# EAGLE design amp-full-0_0_0_1 (EAGLE 6.4)

## Sheet 1 of 3
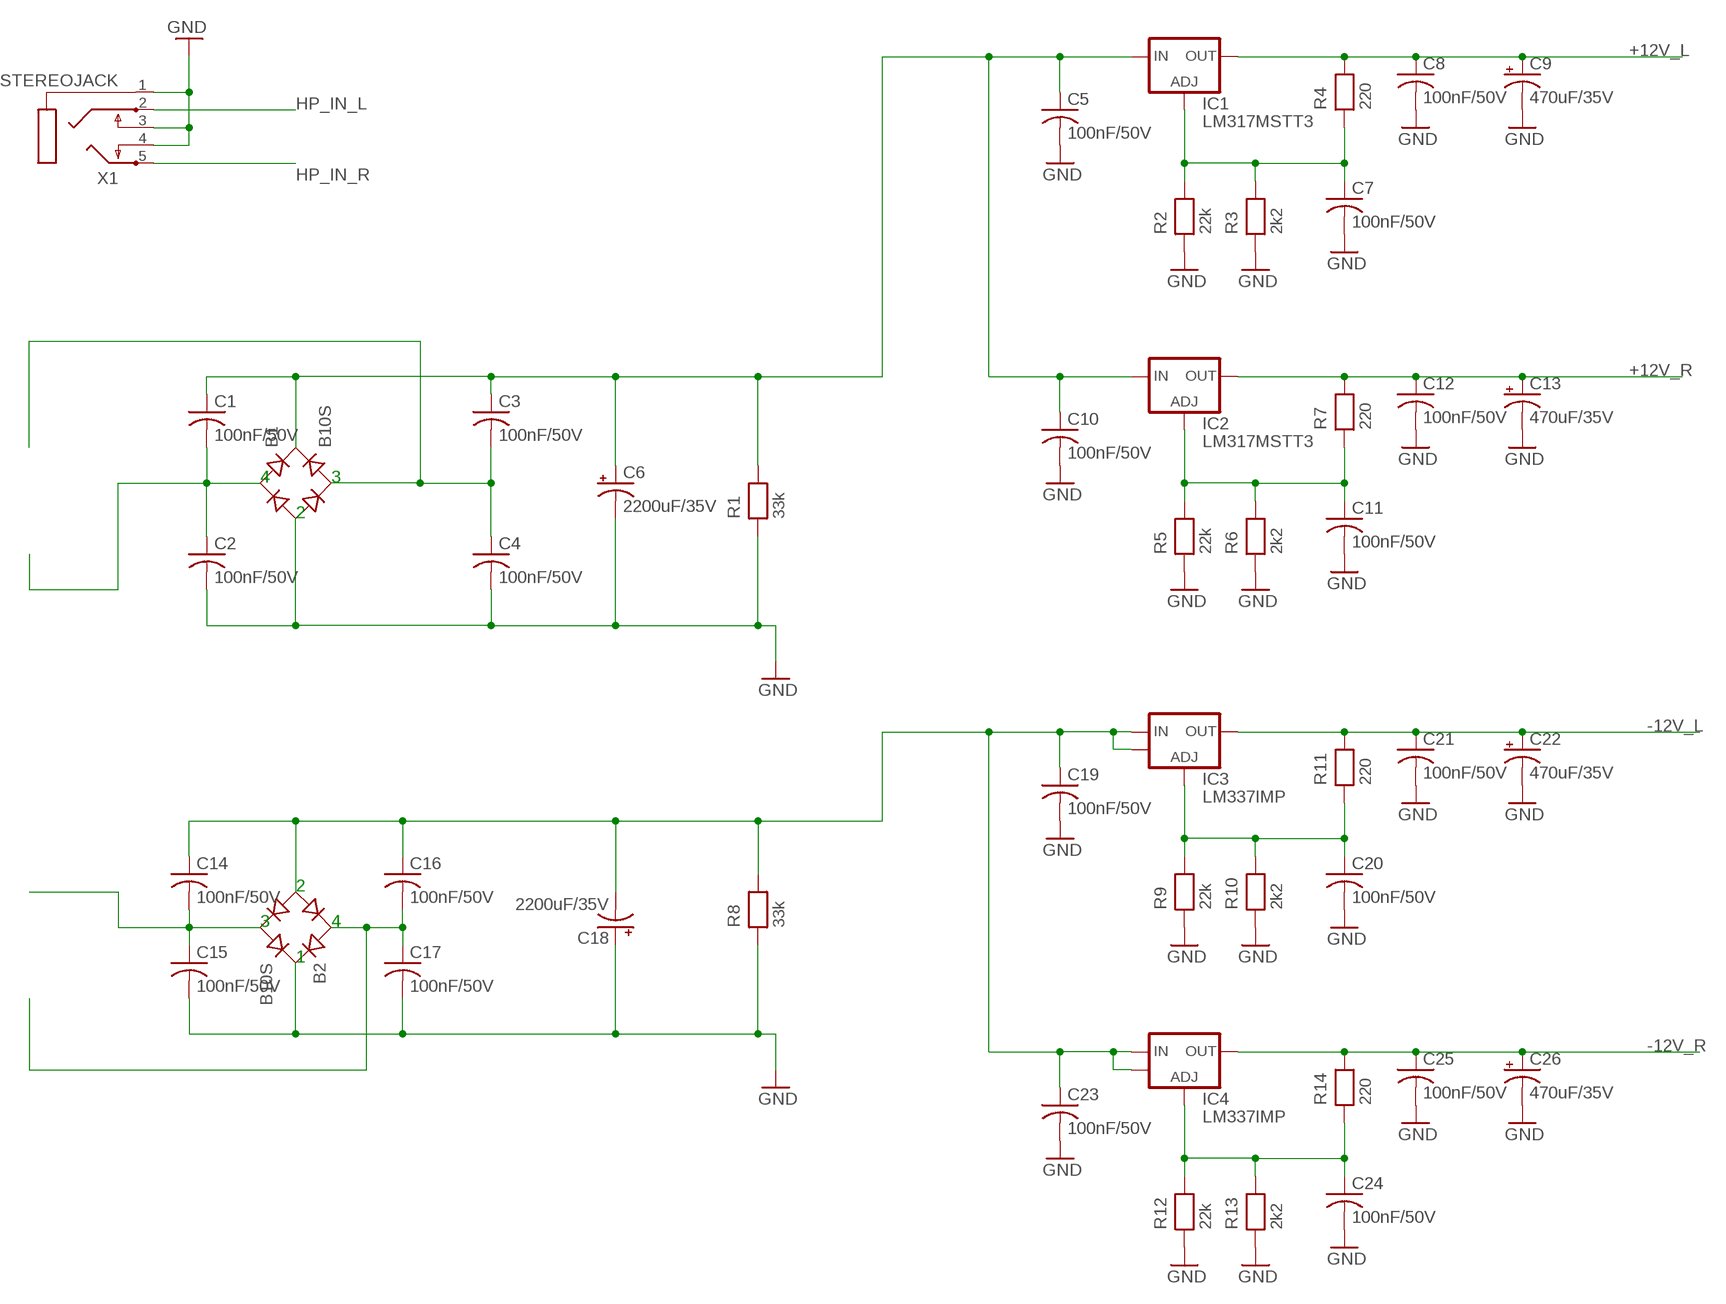
[diagram p0: schematic, sheet 1]

### Parts
B1  B10S  [MBS]
B2  B10S  [MBS]
C1  100nF/50V  C-USC0805  [C0805]
C2  100nF/50V  C-USC0805  [C0805]
C3  100nF/50V  C-USC0805  [C0805]
C4  100nF/50V  C-USC0805  [C0805]
C5  100nF/50V  C-USC0805  [C0805]
C6  2200uF/35V  CPOL-USE7.5-16  [E7,5-16]
C7  100nF/50V  C-USC0805  [C0805]
C8  100nF/50V  C-USC0805  [C0805]
C9  470uF/35V  CPOL-USE3.5-10  [E3,5-10]
C10  100nF/50V  C-USC0805  [C0805]
C11  100nF/50V  C-USC0805  [C0805]
C12  100nF/50V  C-USC0805  [C0805]
C13  470uF/35V  CPOL-USE3.5-10  [E3,5-10]
C14  100nF/50V  C-USC0805  [C0805]
C15  100nF/50V  C-USC0805  [C0805]
C16  100nF/50V  C-USC0805  [C0805]
C17  100nF/50V  C-USC0805  [C0805]
C18  2200uF/35V  CPOL-USE7.5-16  [E7,5-16]
C19  100nF/50V  C-USC0805  [C0805]
C20  100nF/50V  C-USC0805  [C0805]
C21  100nF/50V  C-USC0805  [C0805]
C22  470uF/35V  CPOL-USE3.5-10  [E3,5-10]
C23  100nF/50V  C-USC0805  [C0805]
C24  100nF/50V  C-USC0805  [C0805]
C25  100nF/50V  C-USC0805  [C0805]
C26  470uF/35V  CPOL-USE3.5-10  [E3,5-10]
IC1  LM317MSTT3  [SOT223]
IC2  LM317MSTT3  [SOT223]
IC3  LM337IMP  [SOT-223]
IC4  LM337IMP  [SOT-223]
R1  33k  PRES0805LEVEL3  [R0805]
R2  22k  PRES0805LEVEL3  [R0805]
R3  2k2  PRES0805LEVEL3  [R0805]
R4  220  PRES0805LEVEL3  [R0805]
R5  22k  PRES0805LEVEL3  [R0805]
R6  2k2  PRES0805LEVEL3  [R0805]
R7  220  PRES0805LEVEL3  [R0805]
R8  33k  PRES0805LEVEL3  [R0805]
R9  22k  PRES0805LEVEL3  [R0805]
R10  2k2  PRES0805LEVEL3  [R0805]
R11  220  PRES0805LEVEL3  [R0805]
R12  22k  PRES0805LEVEL3  [R0805]
R13  2k2  PRES0805LEVEL3  [R0805]
R14  220  PRES0805LEVEL3  [R0805]
X1  STEREOJACK  [STX3100]

### Nets
+12V_L: C8.1 C9.+ IC1.4(OUT) R4.P$2 ; also sheet 2,3
+12V_R: C12.1 C13.+ IC2.4(OUT) R7.P$2 ; also sheet 2,3
+VSS_NOREG: B1.+ C1.1 C3.1 C5.1 C6.+ C10.1 IC1.3(IN) IC2.3(IN) R1.P$2
-12V_L: C21.1 C22.+ IC3.3(OUT) R11.P$2 ; also sheet 2,3
-12V_R: C25.1 C26.+ IC4.3(OUT) R14.P$2 ; also sheet 2,3
-VSS_NOREG: B2.- C14.1 C16.1 C18.- C19.1 C23.1 IC3.2(IN) IC3.4 IC4.2(IN) IC4.4 R8.P$2
GND: B1.- B2.+ C2.2 C4.2 C5.2 C6.- C7.2 C8.2 C9.- C10.2 C11.2 C12.2 C13.- C15.2 C17.2 C18.+ C19.2 C20.2 C21.2 C22.- C23.2 C24.2 C25.2 C26.- R1.P$1 R2.P$1 R3.P$1 R5.P$1 R6.P$1 R8.P$1 R9.P$1 R10.P$1 R12.P$1 R13.P$1 X1.1 X1.3 X1.4 ; also sheet 2,3
HP_IN_L: X1.2 ; also sheet 2
HP_IN_R: X1.5 ; also sheet 2
N$1: B1.AC1 C1.2 C2.1
N$2: B1.AC2 C3.2 C4.1
N$4: B2.AC2 C14.2 C15.1
N$7: C7.1 IC1.1(ADJ) R2.P$2 R3.P$2 R4.P$1
N$8: C11.1 IC2.1(ADJ) R5.P$2 R6.P$2 R7.P$1
N$11: B2.AC1 C16.2 C17.1
N$14: C20.1 IC3.1(ADJ) R9.P$2 R10.P$2 R11.P$1
N$17: C24.1 IC4.1(ADJ) R12.P$2 R13.P$2 R14.P$1

### Notes on the sheet
- 4 | 3
- 2
- 2
- 3 | 4
- 1

## Sheet 2 of 3
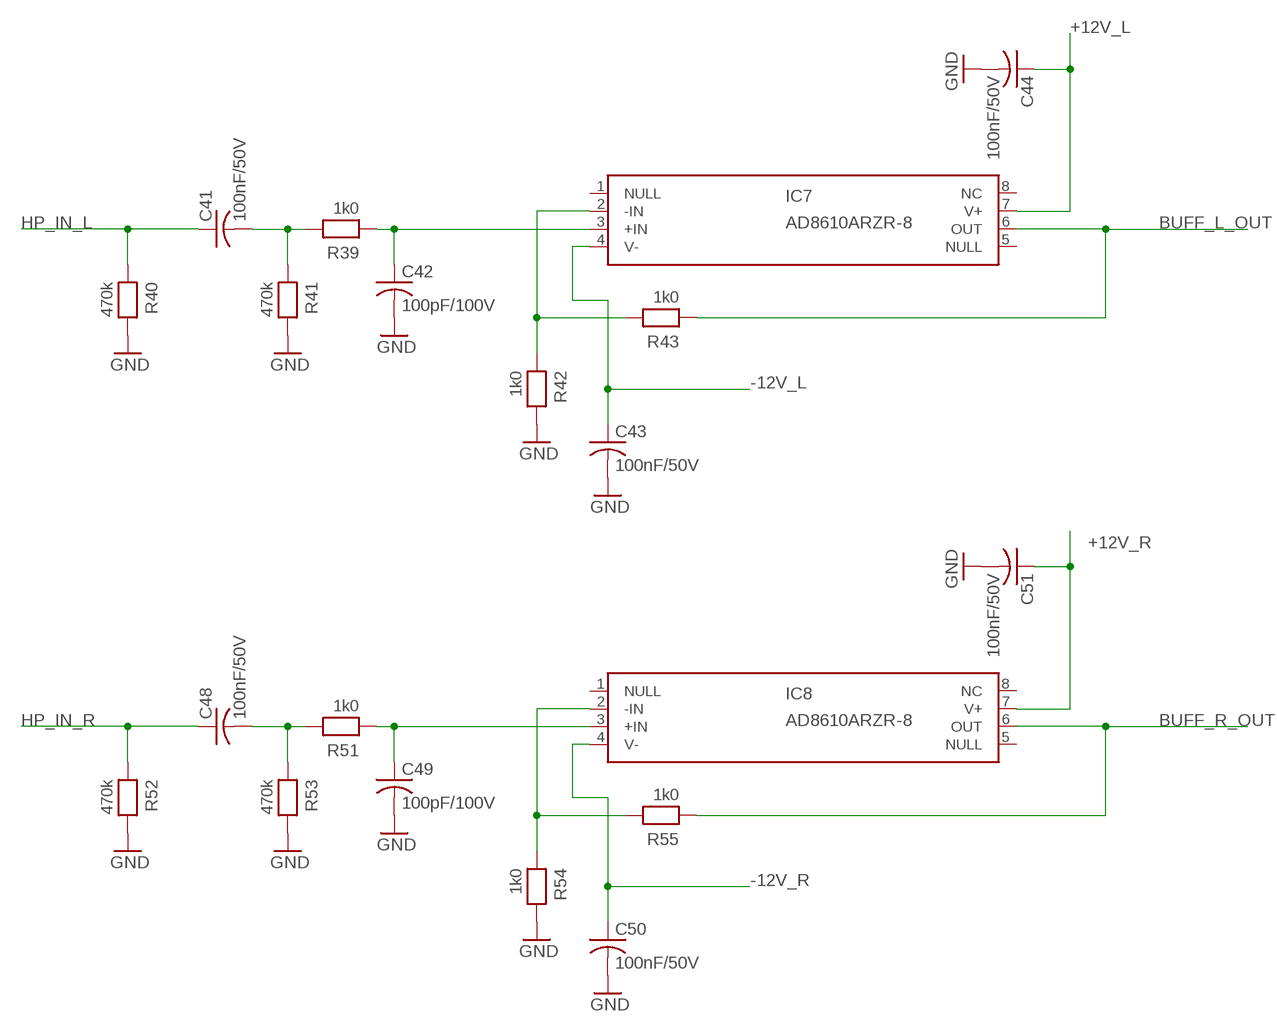
[diagram p1: schematic, sheet 2]

### Parts
C41  100nF/50V  C-USC0805  [C0805]
C42  100pF/100V  C-USC0805  [C0805]
C43  100nF/50V  C-USC0805  [C0805]
C44  100nF/50V  C-USC0805  [C0805]
C48  100nF/50V  C-USC0805  [C0805]
C49  100pF/100V  C-USC0805  [C0805]
C50  100nF/50V  C-USC0805  [C0805]
C51  100nF/50V  C-USC0805  [C0805]
IC7  AD8610ARZR-8  [8-LEAD-SOIC_N]
IC8  AD8610ARZR-8  [8-LEAD-SOIC_N]
R39  1k0  PRES0805LEVEL3  [R0805]
R40  470k  PRES0805LEVEL3  [R0805]
R41  470k  PRES0805LEVEL3  [R0805]
R42  1k0  PRES0805LEVEL3  [R0805]
R43  1k0  PRES0805LEVEL3  [R0805]
R51  1k0  PRES0805LEVEL3  [R0805]
R52  470k  PRES0805LEVEL3  [R0805]
R53  470k  PRES0805LEVEL3  [R0805]
R54  1k0  PRES0805LEVEL3  [R0805]
R55  1k0  PRES0805LEVEL3  [R0805]

### Nets
+12V_L: C44.1 IC7.7(V+) ; also sheet 1,3
+12V_R: C51.1 IC8.7(V+) ; also sheet 1,3
-12V_L: C43.1 IC7.4(V-) ; also sheet 1,3
-12V_R: C50.1 IC8.4(V-) ; also sheet 1,3
BUFF_L_OUT: IC7.6(OUT) R43.P$1 ; also sheet 3
BUFF_R_OUT: IC8.6(OUT) R55.P$1 ; also sheet 3
GND: C42.2 C43.2 C44.2 C49.2 C50.2 C51.2 R40.P$2 R41.P$2 R42.P$2 R52.P$2 R53.P$2 R54.P$2 ; also sheet 1,3
HP_IN_L: C41.1 R40.P$1 ; also sheet 1
HP_IN_R: C48.1 R52.P$1 ; also sheet 1
N$30: C41.2 R39.P$2 R41.P$1
N$31: C42.1 IC7.3(+IN) R39.P$1
N$32: IC7.2(-IN) R42.P$1 R43.P$2
N$39: C48.2 R51.P$2 R53.P$1
N$40: C49.1 IC8.3(+IN) R51.P$1
N$41: IC8.2(-IN) R54.P$1 R55.P$2
Unconnected: IC7.1(NULL) IC7.5(NULL) IC7.8(NC) IC8.1(NULL) IC8.5(NULL) IC8.8(NC)

## Sheet 3 of 3
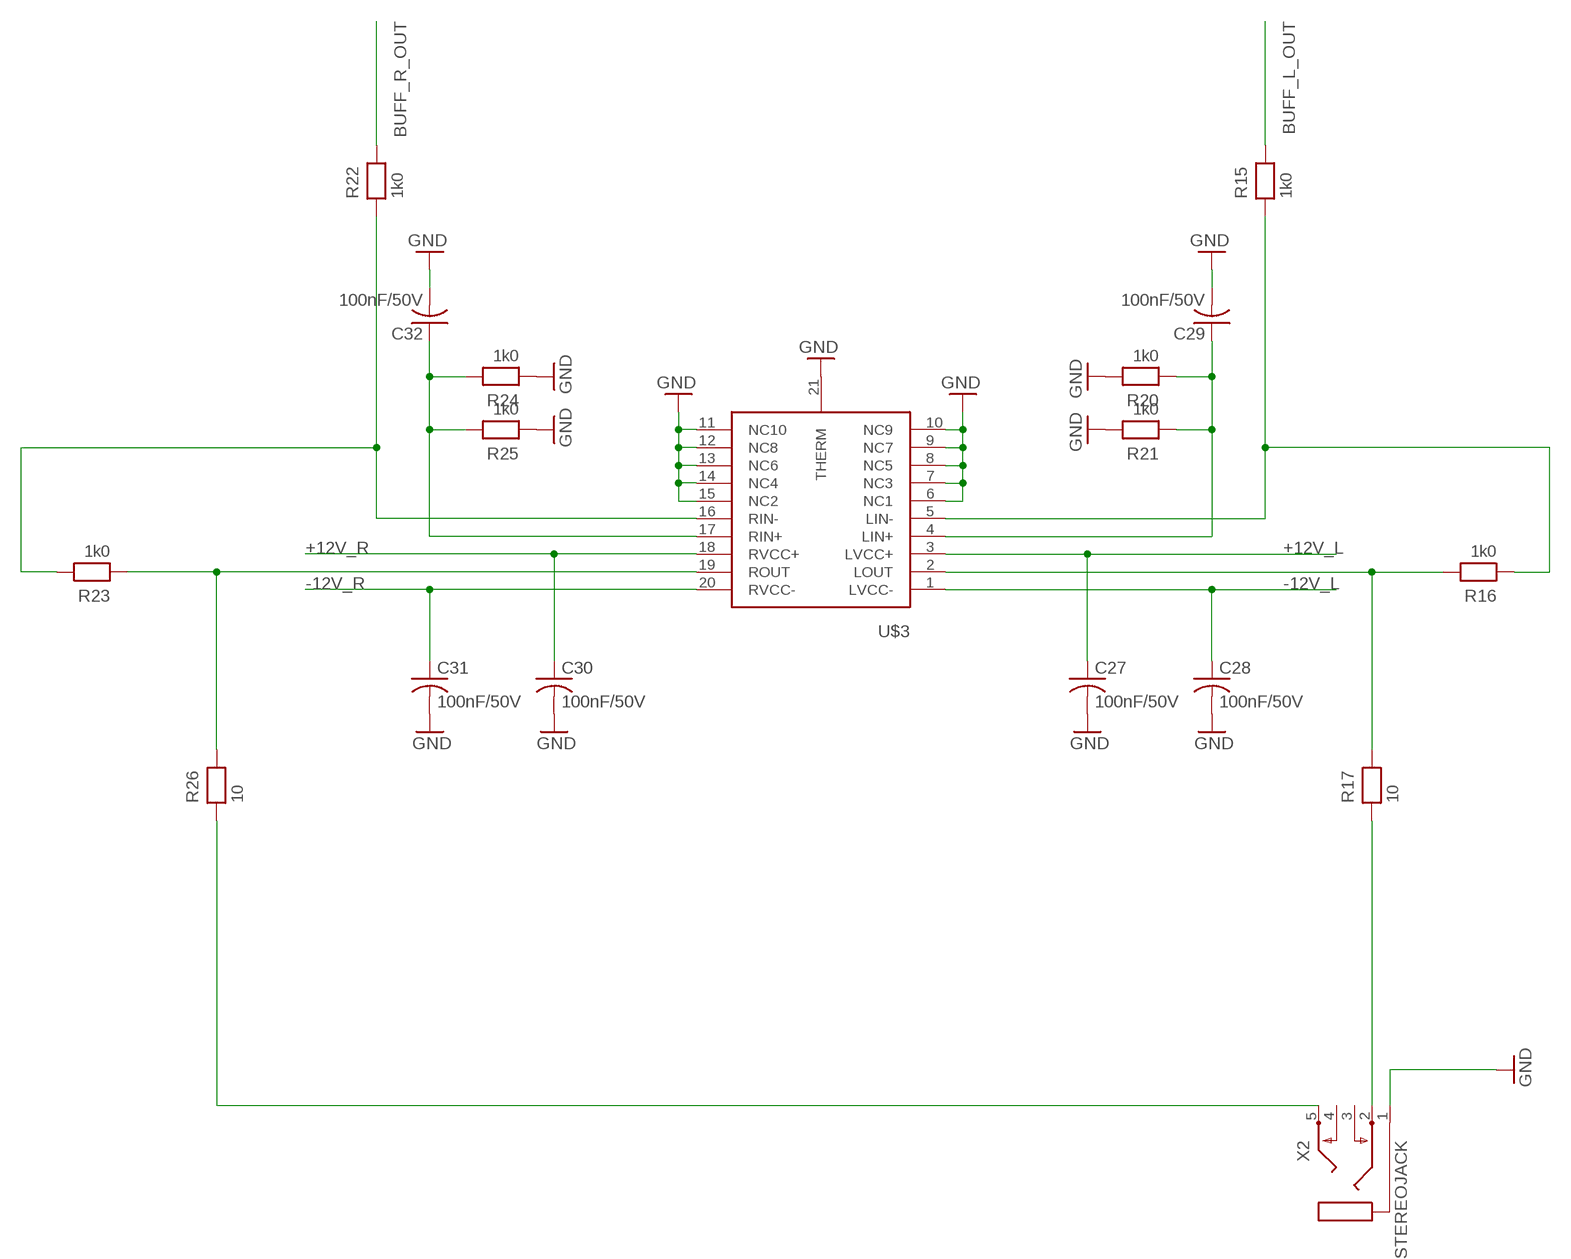
[diagram p2: schematic, sheet 3]

### Parts
C27  100nF/50V  C-USC0805  [C0805]
C28  100nF/50V  C-USC0805  [C0805]
C29  100nF/50V  C-USC0805  [C0805]
C30  100nF/50V  C-USC0805  [C0805]
C31  100nF/50V  C-USC0805  [C0805]
C32  100nF/50V  C-USC0805  [C0805]
R15  1k0  PRES0805LEVEL3  [R0805]
R16  1k0  PRES0805LEVEL3  [R0805]
R17  10  PRES0805LEVEL3  [R0805]
R20  1k0  PRES0805LEVEL3  [R0805]
R21  1k0  PRES0805LEVEL3  [R0805]
R22  1k0  PRES0805LEVEL3  [R0805]
R23  1k0  PRES0805LEVEL3  [R0805]
R24  1k0  PRES0805LEVEL3  [R0805]
R25  1k0  PRES0805LEVEL3  [R0805]
R26  10  PRES0805LEVEL3  [R0805]
U$3  TPA6120  [TPA6120]
X2  STEREOJACK  [STX3100]

### Nets
+12V_L: C27.1 U$3.3(LVCC+) ; also sheet 1,2
+12V_R: C30.1 U$3.18(RVCC+) ; also sheet 1,2
-12V_L: C28.1 U$3.1(LVCC-) ; also sheet 1,2
-12V_R: C31.1 U$3.20(RVCC-) ; also sheet 1,2
BUFF_L_OUT: R15.P$2 ; also sheet 2
BUFF_R_OUT: R22.P$2 ; also sheet 2
GND: C27.2 C28.2 C29.2 C30.2 C31.2 C32.2 R20.P$2 R21.P$2 R24.P$1 R25.P$1 U$3.6(NC1) U$3.7(NC3) U$3.8(NC5) U$3.9(NC7) U$3.10(NC9) U$3.11(NC10) U$3.12(NC8) U$3.13(NC6) U$3.14(NC4) U$3.15(NC2) U$3.21(THERM) X2.1 ; also sheet 1,2
N$5: R15.P$1 R16.P$1 U$3.5(LIN-)
N$6: R16.P$2 R17.P$2 U$3.2(LOUT)
N$10: R17.P$1 X2.2
N$13: C29.1 R20.P$1 R21.P$1 U$3.4(LIN+)
N$15: R22.P$1 R23.P$2 U$3.16(RIN-)
N$16: R23.P$1 R26.P$2 U$3.19(ROUT)
N$18: C32.1 R24.P$2 R25.P$2 U$3.17(RIN+)
N$20: R26.P$1 X2.5
Unconnected: X2.3 X2.4

## Library data of the parts
B1 B2 = rectifier:B*S: Surface Mount Glass Passivated Bridge Rectifiers Source: Comchip Bridge Rectifiers B05S-G_B10S-G.pdf
C1-C5 C7 C8 C10-C12 C14-C17 C19-C21 C23-C25 C27-C32 C41-C44 C48-C51 = rcl:C-US: CAPACITOR, American symbol
C6 C9 C13 C18 C22 C26 = rcl:CPOL-US: POLARIZED CAPACITOR, American symbol
IC1 IC2 = v-reg:LM317?*: 500 mA Adjustable Output Positive Voltage Regulator Source: http://www.onsemi.co.jp .. LM317M-D.PDF
IC3 IC4 = AWJLEagleLib:LM337: LM337 adjustable negative voltage regulator
IC7 IC8 = ad8610arz:AD8610ARZ: edit this description Auto generated by make-symbol-device-package-bsdl.ulp Rev. 43 Source:
R1-R17 R20-R26 R39-R43 R51-R55 = rcl_pro:PRES0805
U$3 = tpa6120:TPA6120
X1 X2 = adafruit:STEREOJACK: MIC/HEADPHONE JACK Stereo jack with two switches. Kycon STX3100, CUI SJ1-3555NG and/or 4UCon 05544

## Board
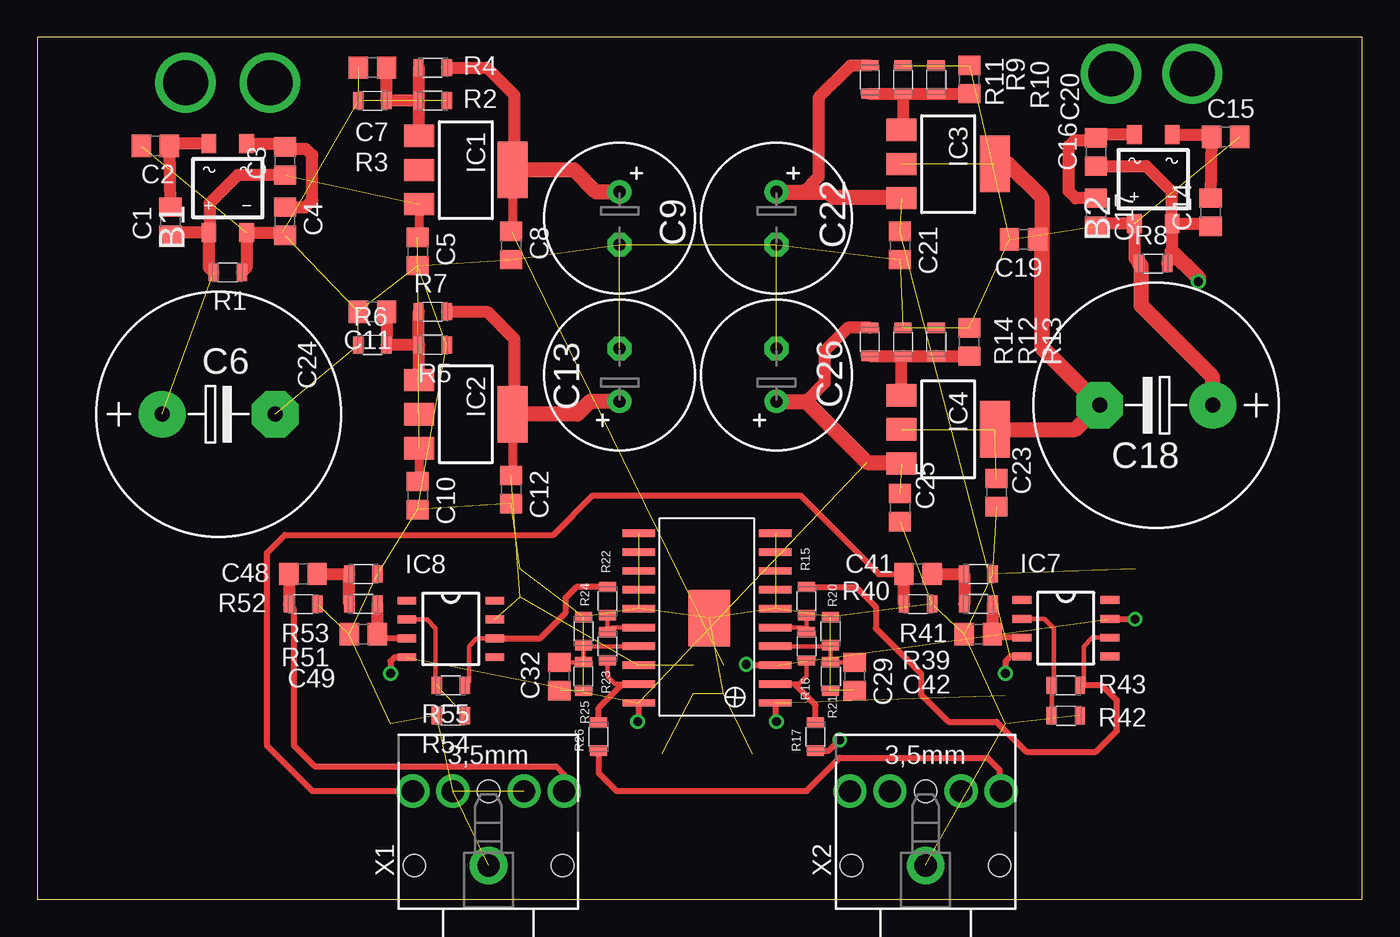
[diagram p3: board, top side]
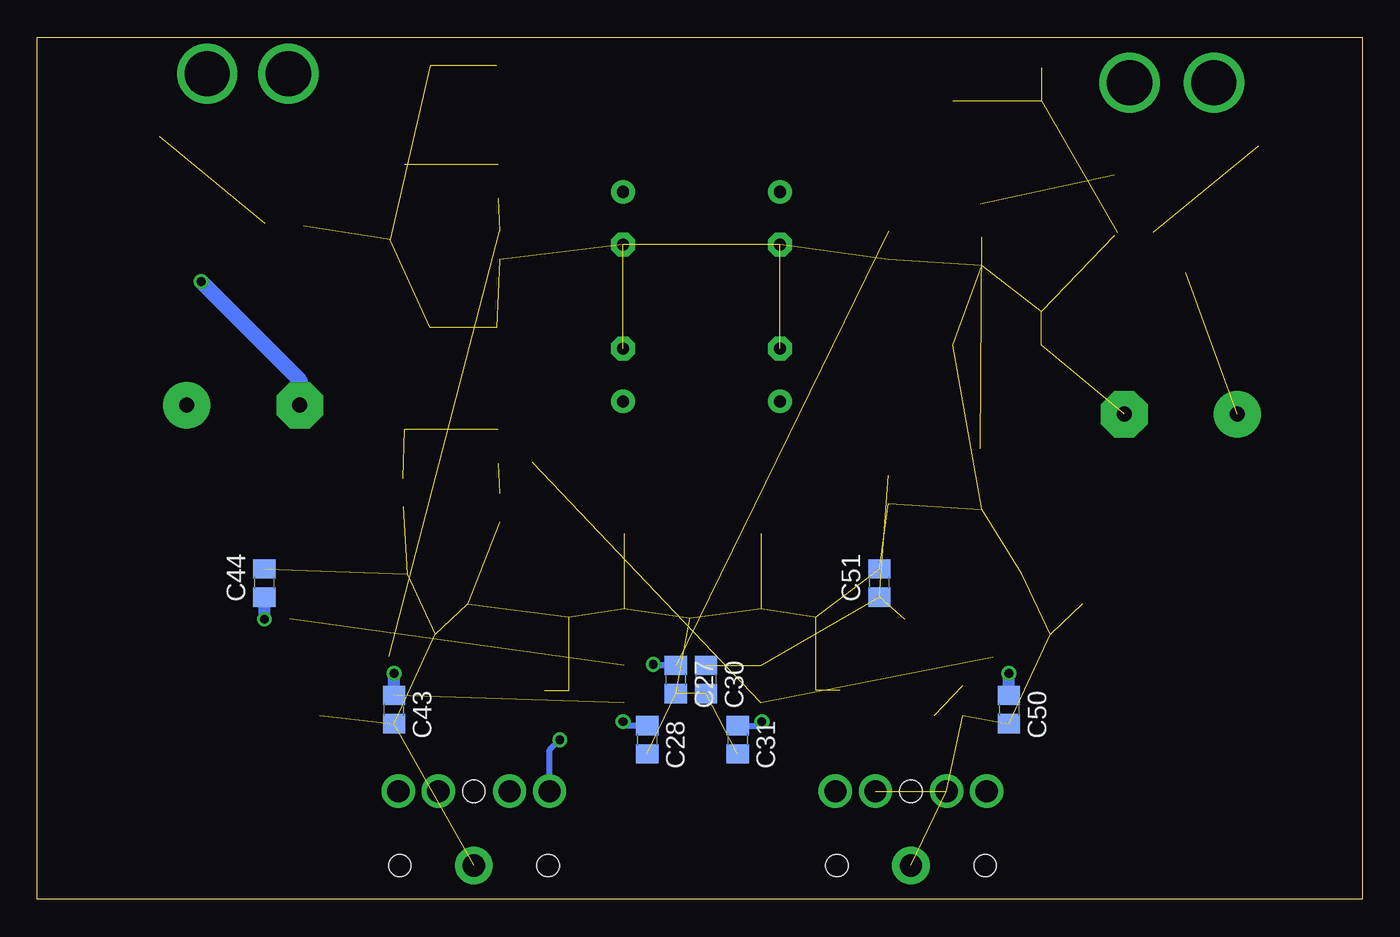
[diagram p4: board, bottom side, seen from below]

Size 89.34 x 58.14 mm. Coordinates in mm from the lower left corner, seen from the top.
Outline: 0,0 89.34,0 89.34,58.14 0,58.14 0,0
Copper layers (1*16): Top 0.035mm / dielectric 1.5mm / Bottom 0.035mm
Design rules "default": minimum track width 10mil, minimum drill 24mil, track to track 8mil, track to pad 8mil, pad to pad 8mil, via to via 8mil, smd to smd 8mil, copper to edge 40mil, drill to drill 8mil, minimum pad ring 10mil, minimum via ring 8mil, stop-mask expansion 4mil, vias tented up to drill 0mil, thermal gap 10mil

### Footprints (pad centres in the part's own frame; a part is rotated, then mirrored left to right if it is on the bottom)
MBS = smd 1 x 1.3: + -1.27,-3; - 1.27,-3; AC1 -1.27,3; AC2 1.27,3
C0805 = smd 1.3 x 1.5: 1 -0.95,0; 2 0.95,0
E7,5-16 = drill 1.016 pad 3.15: + -3.81,0 | drill 1.016 pad 3.15 octagon: - 3.81,0
E3,5-10 = drill 0.813 pad 1.6: + -1.778,0 | drill 0.813 pad 1.6 octagon: - 1.778,0
SOT223 = smd 1.5 x 2: 1 -2.3,-3.15; 2 0,-3.15; 3 2.3,-3.15 | smd 3.8 x 2: 4 0,3.15
SOT-223 = smd 1.5 x 2: 1 -2.3,-3.15; 2 0,-3.15; 3 2.3,-3.15 | smd 3.8 x 2: 4 0,3.15
8-LEAD-SOIC_N = smd 1.27 x 0.53: 1 -2.965,1.905; 2 -2.965,0.635; 3 -2.965,-0.635; 4 -2.965,-1.905; 5 2.965,-1.905; 6 2.965,-0.635; 7 2.965,0.635; 8 2.965,1.905
R0805 = smd 0.7 x 1.15: P$1 -0.95,0; P$2 0.95,0
TPA6120 = smd 0.5 x 2.2: 1 0.25,1.095; 2 1.52,1.095; 3 2.79,1.095; 4 4.06,1.095; 5 5.33,1.095; 6 6.6,1.095; 7 7.87,1.095; 8 9.14,1.095; 9 10.41,1.095; 10 11.68,1.095; 11 11.68,10.295; 12 10.41,10.295; 13 9.14,10.295; 14 7.87,10.295; 15 6.6,10.295; 16 5.33,10.295; 17 4.06,10.295; 18 2.79,10.295; 19 1.52,10.295; 20 0.25,10.295 | smd 3.81 x 2.79: 21 5.965,5.54
STX3100 = drill 1.5 pad 2.54: 1 2.7,-0.1 | drill 1.5: 2 7.7,5; 3 7.7,2.3; 4 7.7,-2.5; 5 7.7,-5.2 | hole 1.5: 2.7,4.9; 2.7,-5.1; 7.7,-0.1

### Placement (x,y rotation side)
B1  12.85,47.96 0 top
B2  75.23,48.56 0 top
C1  8.99,45.72 90 top
C2  7.98,50.8 180 top
C3  16.71,49.78 90 top
C4  16.71,45.72 270 top
C5  25.65,43.69 270 top
C6  12.24,32.72 0 top
C7  22.61,56.08 180 top
C8  31.95,44.09 270 top
C9  39.27,45.92 270 top
C10  25.65,27.23 270 top
C11  22.61,39.62 180 top
C12  31.95,27.64 270 top
C13  39.27,35.36 90 top
C14  79.1,46.33 90 top
C15  80.11,51.41 0 top
C16  71.37,50.39 90 top
C17  71.37,46.33 270 top
C18  75.44,33.32 180 top
C19  66.5,44.5 180 top
C20  62.84,55.27 90 top
C21  58.17,44.09 270 top
C22  49.83,45.92 270 top
C23  64.67,27.43 270 top
C24  62.84,37.59 90 top
C25  58.17,26.42 270 top
C26  49.83,35.36 90 top
C27  46.28,14.83 270 bottom
C28  48.21,10.77 270 bottom
C29  55.12,15.04 270 top
C30  44.25,14.83 270 bottom
C31  42.11,10.77 270 bottom
C32  35.2,15.04 270 top
C41  59.39,21.95 0 top
C42  63.45,17.88 180 top
C43  65.28,12.8 270 bottom
C44  74.02,21.34 90 bottom
C48  17.93,21.95 0 top
C49  22,17.88 180 top
C50  23.83,12.8 270 bottom
C51  32.56,21.34 90 bottom
IC1  28.91,49.17 270 top
IC2  28.91,32.72 270 top
IC3  61.42,49.58 270 top
IC4  61.42,31.7 270 top
IC7  69.34,18.29 0 top
IC8  27.89,18.24 0 top
R1  12.85,42.27 180 top
R2  26.67,53.85 180 top
R3  22.61,53.85 0 top
R4  26.67,56.08 0 top
R5  26.67,37.39 180 top
R6  22.61,37.39 0 top
R7  26.67,39.62 0 top
R8  75.23,42.88 0 top
R9  58.37,55.27 270 top
R10  60.6,55.27 270 top
R11  56.13,55.27 90 top
R12  58.37,37.59 270 top
R13  60.6,37.59 270 top
R14  56.13,37.59 90 top
R15  51.87,20.12 90 top
R16  51.87,17.07 270 top
R17  52.48,10.97 90 top
R20  53.49,18.08 90 top
R21  53.49,15.04 270 top
R22  38.46,20.12 90 top
R23  38.46,17.07 90 top
R24  36.83,18.08 270 top
R25  36.83,15.04 90 top
R26  37.85,10.97 90 top
R39  63.45,19.91 180 top
R40  59.39,19.91 0 top
R41  63.45,21.95 0 top
R42  69.34,12.4 0 top
R43  69.34,14.43 180 top
R51  22,19.91 180 top
R52  17.93,19.91 0 top
R53  22,21.95 0 top
R54  27.89,12.4 180 top
R55  27.89,14.43 180 top
U$3  50.85,13 90 top
X1  30.33,-0.41 90 top
X2  59.79,-0.41 90 top

### Tracks (layer width: path | path; a pad name or v marks a point on that pad's centre or on a via)
+12V_L  (via drill 0.6)  (2 unrouted)
  Top 0.406: IC7.7 73.99,18.92 v74.02,18.9 | U$3.3 47.86,15.8 v47.8,15.85
  Top 0.61: IC1.4 32.06,45.15 C8.1
  Top 0.813: R4.P$2 30.33,56.08 32.16,54.25 32.16,49.28 IC1.4
  Top 1.016: C9.+ 37.69,47.7 36.22,49.17 IC1.4
  Bottom 0.406: C27.1 47.74,15.78 v47.8,15.85
  Bottom 0.813: C44.1 v74.02,18.9
+12V_R  (4 unrouted)
  Top 0.61: IC2.4 32.06,28.69 C12.1
  Top 0.813: R7.P$2 30.33,39.62 32.16,37.8 32.16,32.82 IC2.4
  Top 1.016: C13.+ 37.29,33.58 36.42,32.72 IC2.4
+VSS_NOREG  (3 unrouted)
  Top 0.61: IC2.3 25.76,28.28 C10.1 | IC1.3 25.76,44.74 C5.1
  Top 0.813: B1.+ 9.18,44.96 C1.1 | B1.+ 11.58,42.59 R1.P$2 | C3.1 13.53,48.83 11.63,46.94 11.63,45.01 B1.+
-12V_L  (via drill 0.6)  (3 unrouted)
  Top 0.406: IC7.4 65.61,16.38 65.28,16.05 v65.28,15.24 | U$3.1 49.76,12.07 v49.84,11.99
  Top 0.813: R11.P$2 54.85,56.22 52.68,54.05 52.68,48.72 51.66,47.7
  Top 1.016: C22.+ 51.66,47.7 53.34,47.7 53.7,47.35 58.2,47.35 IC3.3
  Bottom 0.406: C28.1 49.57,11.72 v49.84,11.99
  Bottom 0.813: C43.1 v65.28,15.24
-12V_R  (via drill 0.6)  (3 unrouted)
  Top 0.406: IC8.4 24.1,16.33 23.83,16.05 v23.83,15.24 | U$3.20 40.56,12.06 v40.49,11.99
  Top 0.813: R14.P$2 54.65,38.54 53.09,36.98 53.09,34.85 51.82,33.58
  Top 1.016: C26.+ 51.82,33.58 55.93,29.46 58.2,29.46 IC4.3
  Bottom 0.406: C31.1 40.76,11.72 v40.49,11.99
  Bottom 0.813: C50.1 v23.83,15.24
-VSS_NOREG  (via drill 0.6)  (3 unrouted)
  Top 0.813: B2.- 78.91,45.56 C14.1 | B2.- 76.51,43.69 76.51,43.2 R8.P$2 | C16.1 74.76,49.44 76.45,47.75 76.45,45.62 B2.-
  Top 1.016: IC3.4 65.48,49.58 67.72,47.35 67.72,44.77 | IC4.4 70,31.7 C18.- 67.72,37.24 67.72,44.23 C19.1 67.72,44.77 | 67.72,44.77 67.72,37.19 v71.58,33.32 | v78.28,41.66 78.28,41.91 76.51,43.69
  Bottom 1.016: v71.58,33.32 71.58,34.95 v78.28,41.66
BUFF_L_OUT
  Top 0.305: IC7.6 71.15,17.65 70.56,17.07 70.56,14.7 R43.P$1
  Top 0.406: R15.P$2 55.18,21.07 56.54,19.71 56.54,18.29 59.59,15.24 59.59,13.82 61.42,11.99 64.67,11.99 66.7,9.96 71.37,9.96 72.8,11.38 72.8,13.41 71.78,14.43 R43.P$1
BUFF_R_OUT
  Top 0.305: IC8.6 29.64,17.6 29.11,17.07 29.11,14.7 R55.P$1
  Top 0.406: R22.P$2 36.36,21.07 35.61,20.32 35.61,19.3 33.91,17.6 IC8.6
GND  (65 unrouted)
  Top 0.813: C4.2 16.53,44.96 B1.- 14.12,42.59 R1.P$1 | C17.2 71.56,45.56 B2.+ 73.97,43.2 R8.P$1
  Top 1.016: C18.+ 79.25,35.2 74.42,40.03 74.42,42.74 R8.P$1
HP_IN_L
  Top 0.406: X1.2 18.56,7.29 15.49,10.36 15.49,23.37 16.71,24.59 34.8,24.59 37.44,27.23 51.46,27.23 56.74,21.95 C41.1
  Top 0.813: R40.P$1 C41.1
HP_IN_R
  Top 0.406: X1.5 35.53,8.41 35,8.94 18.75,8.94 17.32,10.36 17.32,19.57 R52.P$1
  Top 0.813: C48.1 R52.P$1
N$1
  Top 0.813: B1.AC1 9.11,50.96 C2.1 C1.2
N$2
  Top 0.813: C4.1 18.07,46.67 18.54,47.14 18.54,50.19 18.14,50.6 16.85,50.6 C3.2 16.49,50.96 B1.AC2
N$4
  Top 0.813: C14.2 C15.1 78.98,51.56 B2.AC2
N$5
  Top 0.305: U$3.5 51.55,18.34 R16.P$1 R15.P$1
N$6
  Top 0.305: U$3.2 51.05,14.53 51.36,14.53 51.87,15.04 R16.P$2
  Top 0.406: R17.P$2 52.48,13.1 51.05,14.53
N$7
  Top 0.813: R4.P$1 R2.P$2 | R2.P$2 R3.P$2 C7.1 | IC1.1 25.76,53.81 R2.P$2
N$8
  Top 0.813: R5.P$2 R7.P$1 | R5.P$2 R6.P$2 C11.1 | IC2.1 25.76,37.35 R5.P$2
N$9  (via drill 3.05)
  other vias: 15.7,55.07
N$10  (via drill 0.6)
  Top 0.406: R17.P$1 53.36,10.02 v54.1,10.77
  Bottom 0.406: X2.2 54.79,10.08 v54.1,10.77
N$11
  Top 0.813: C17.1 70.02,47.28 69.55,47.75 69.55,50.8 69.95,51.21 71.24,51.21 C16.2 71.6,51.56 B2.AC1
N$13
  Top 0.305: U$3.4 53.42,17.07 R20.P$1 R21.P$1 C29.1
N$14
  Top 0.813: R11.P$1 R9.P$2 | R9.P$2 R10.P$2 C20.1 | R9.P$2 58.37,51.88 IC3.1
N$15
  Top 0.305: U$3.16 38.77,18.34 R23.P$2 R22.P$1
N$16
  Top 0.305: U$3.19 39.47,14.53 38.97,14.53 38.46,15.04 R23.P$1
  Top 0.406: R26.P$2 37.85,12.9 39.47,14.53
N$17
  Top 0.813: R14.P$1 R12.P$2 | R12.P$2 R13.P$2 C24.1 | IC4.1 58.27,36.54 R12.P$2
N$18
  Top 0.305: C32.1 R25.P$2 R24.P$2 36.9,17.07 U$3.17
N$20
  Top 0.406: R26.P$1 37.85,8.53 39.07,7.32 51.87,7.32 54.1,9.55 64.06,9.55 64.87,8.74 64.87,7.41 X2.5
N$21  (via drill 3.05)
  other vias: 10.01,55.07
N$22  (via drill 3.05)
  other vias: 77.88,55.68
N$23  (via drill 3.05)
  other vias: 72.39,55.68
N$30
  Top 0.813: C41.2 R41.P$1 R39.P$2
N$31
  Top 0.406: IC7.3 64.63,17.65 C42.1
  Top 0.813: R39.P$1 C42.1
N$32
  Top 0.305: IC7.2 67.89,18.92 68.53,18.29 68.53,14.56 R43.P$2 R42.P$1
N$39
  Top 0.813: R51.P$2 R53.P$1 C48.2
N$40
  Top 0.406: IC8.3 23.23,17.6 C49.1
  Top 0.813: C49.1 R51.P$1
N$41  (1 unrouted)
  Top 0.305: IC8.2 26.29,18.87 26.87,18.29 26.87,14.49 R55.P$2